# Altium schematic sheet 5_AnalogSense.SchDoc
size A4
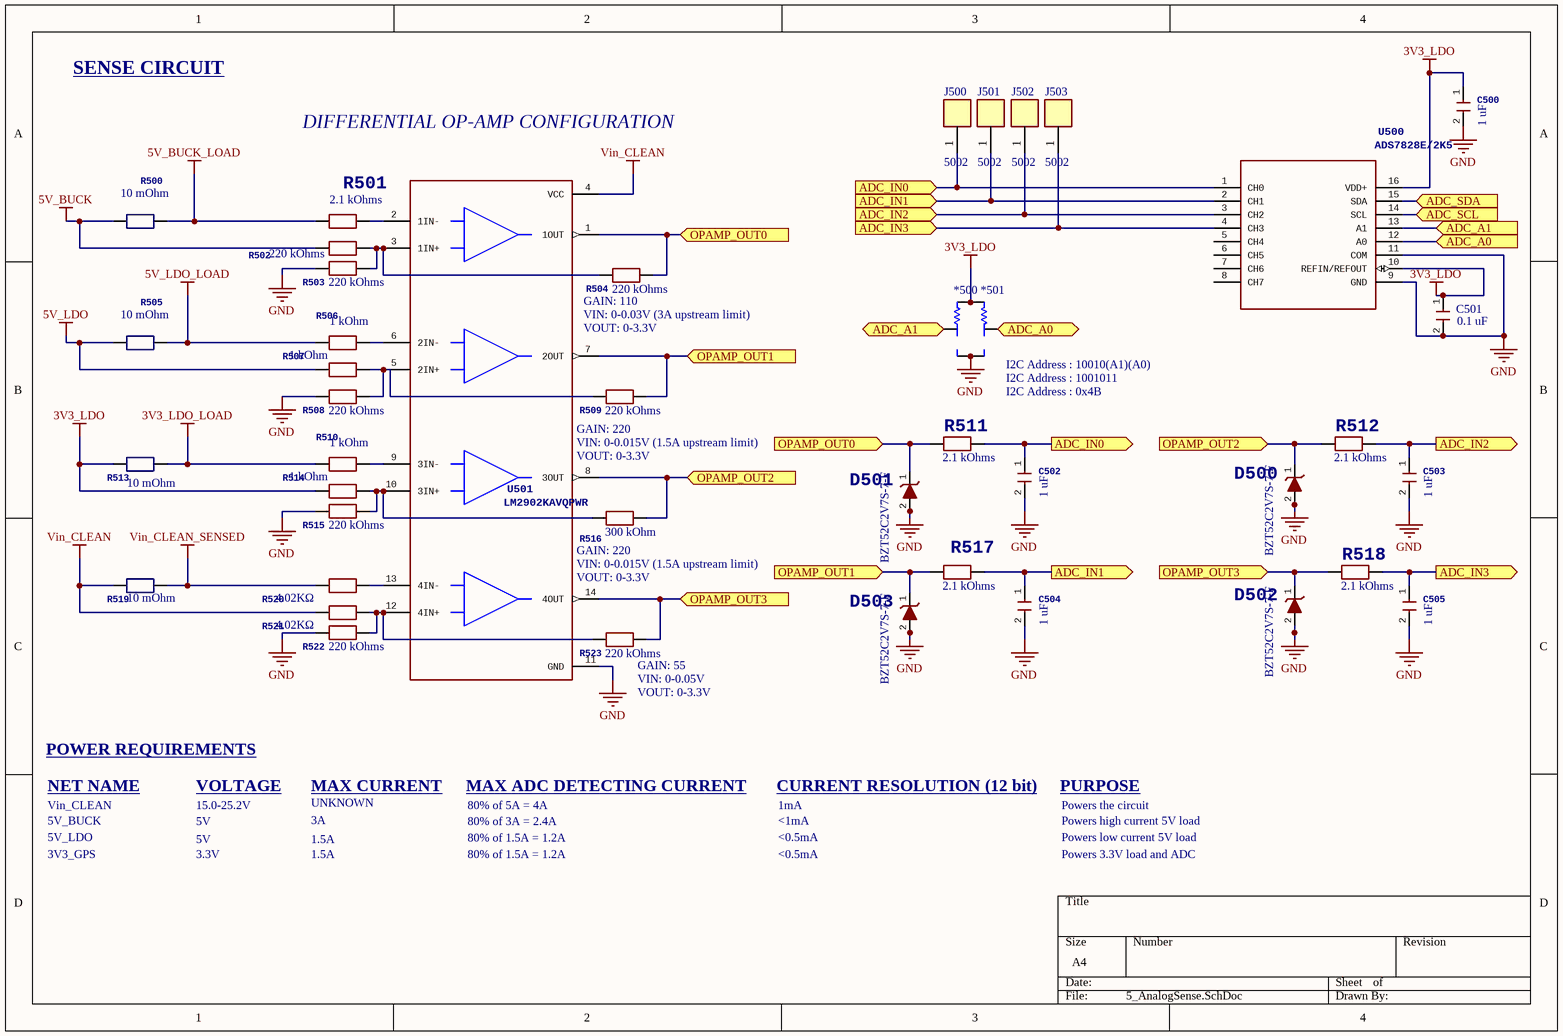
[diagram p0: 5_AnalogSense.SchDoc]

## Parts
*500  3-pin selection 0603  [3-PIN SELECTION CIRCUIT]  (value not drawn)
*501  3-pin selection 0603  [3-PIN SELECTION CIRCUIT]  (value not drawn)
C500  value 1 uF  [CAP_0603]  (hidden comment: GRT188R61H105KE13D)
C501  value 0.1 uF  [CAP_0603]  (hidden comment: CL10B104KB8NNNC)
C502  value 1 uF  [CAP_0603]  (hidden comment: GRT188R61H105KE13D)
C503  value 1 uF  [CAP_0603]  (hidden comment: GRT188R61H105KE13D)
C504  value 1 uF  [CAP_0603]  (hidden comment: GRT188R61H105KE13D)
C505  value 1 uF  [CAP_0603]  (hidden comment: GRT188R61H105KE13D)
D500  BZT52C2V7S-7-F  [DIODE_DO-214AC]
D501  BZT52C2V7S-7-F  [DIODE_DO-214AC]
D502  BZT52C2V7S-7-F  [DIODE_DO-214AC]
D503  BZT52C2V7S-7-F  [DIODE_DO-214AC]
J500  5002  [KEYSTONE_5002]
J501  5002  [KEYSTONE_5002]
J502  5002  [KEYSTONE_5002]
J503  5002  [KEYSTONE_5002]
R500  value 10 mOhm  [RES_0805]  (hidden comment: ERJ6CWFR010V)
R501  value 2.1 kOhms  [RES_0603]  (hidden comment: ERJ-3EKF2101V)
R502  value 220 kOhms  [RES_0603]  (hidden comment: ERJ3EKF2203V)
R503  value 220 kOhms  [RES_0603]  (hidden comment: ERJ3EKF2203V)
R504  value 220 kOhms  [RES_0603]  (hidden comment: ERJ3EKF2203V)
R505  value 10 mOhm  [RES_0805]  (hidden comment: ERJ6CWFR010V)
R506  value 1 kOhm  [RES_0603]  (hidden comment: ERJ3GEYJ102V)
R507  value 1 kOhm  [RES_0603]  (hidden comment: ERJ3GEYJ102V)
R508  value 220 kOhms  [RES_0603]  (hidden comment: ERJ3EKF2203V)
R509  value 220 kOhms  [RES_0603]  (hidden comment: ERJ3EKF2203V)
R510  value 1 kOhm  [RES_0603]  (hidden comment: ERJ3GEYJ102V)
R511  value 2.1 kOhms  [RES_0603]  (hidden comment: ERJ-3EKF2101V)
R512  value 2.1 kOhms  [RES_0603]  (hidden comment: ERJ-3EKF2101V)
R513  value 10 mOhm  [RES_0805]  (hidden comment: ERJ6CWFR010V)
R514  value 1 kOhm  [RES_0603]  (hidden comment: ERJ3GEYJ102V)
R515  value 220 kOhms  [RES_0603]  (hidden comment: ERJ3EKF2203V)
R516  value 300 kOhm  [RES_0603]  (hidden comment: ERJ3GEYJ304V)
R517  value 2.1 kOhms  [RES_0603]  (hidden comment: ERJ-3EKF2101V)
R518  value 2.1 kOhms  [RES_0603]  (hidden comment: ERJ-3EKF2101V)
R519  value 10 mOhm  [RES_0805]  (hidden comment: ERJ6CWFR010V)
R520  value 4.02KΩ  [RES_0603]  (hidden comment: ERA3AEB4021V)
R521  value 4.02KΩ  [RES_0603]  (hidden comment: ERA3AEB4021V)
R522  value 220 kOhms  [RES_0603]  (hidden comment: ERJ3EKF2203V)
R523  value 220 kOhms  [RES_0603]  (hidden comment: ERJ3EKF2203V)
U500  ADS7828E/2K5  [ADC-TSSOP-16]
U501  LM2902KAVQPWR  [OPAMP_TSSOP-14]

## Ports
ADC_A0 (in), ADC_A1 (in), ADC_IN0 (in), ADC_IN0 (out), ADC_IN1 (in), ADC_IN1 (out), ADC_IN2 (in), ADC_IN2 (out), ADC_IN3 (in), ADC_IN3 (out), ADC_SCL (in), ADC_SDA (in), OPAMP_OUT0 (in), OPAMP_OUT1 (in), OPAMP_OUT2 (in), OPAMP_OUT3 (in)

## Nets
3V3_LDO: *500.3 *501.3 C500.1 C501.1 R513.1 R514.1 U500.10(REFIN/REFOUT) U500.16(VDD+)
3V3_LDO_LOAD: R510.1 R513.2
5V_BUCK: R500.1 R502.1
5V_BUCK_LOAD: R500.2 R501.1
5V_LDO: R505.1 R507.1
5V_LDO_LOAD: R505.2 R506.1
GND: *500.1 *501.1 C500.2 C501.2 C502.2 C503.2 C504.2 C505.2 D500.2 D501.2 D502.2 D503.2 R503.1 R508.1 R515.1 R522.1 U500.9(GND) U500.11(COM) U501.11(GND)
Vin_CLEAN: R519.1 R521.1 U501.4(VCC)
Vin_CLEAN_SENSED: R519.2 R520.1
ADC_A0: *501.2 U500.12(A0) ; port ADC_A0
ADC_A1: *500.2 U500.13(A1) ; port ADC_A1
ADC_IN0: C502.1 J500.1 R511.2 U500.1(CH0) ; port ADC_IN0
ADC_IN1: C504.1 J501.1 R517.2 U500.2(CH1) ; port ADC_IN1
ADC_IN2: C503.1 J502.1 R512.2 U500.3(CH2) ; port ADC_IN2
ADC_IN3: C505.1 J503.1 R518.2 U500.4(CH3) ; port ADC_IN3
ADC_SCL: U500.14(SCL) ; port ADC_SCL
ADC_SDA: U500.15(SDA) ; port ADC_SDA
OPAMP_OUT0: D501.1 R504.2 R511.1 U501.1(1OUT) ; port OPAMP_OUT0
OPAMP_OUT1: D503.1 R509.2 R517.1 U501.7(2OUT) ; port OPAMP_OUT1
OPAMP_OUT2: D500.1 R512.1 R516.2 U501.8(3OUT) ; port OPAMP_OUT2
OPAMP_OUT3: D502.1 R518.1 R523.2 U501.14(4OUT) ; port OPAMP_OUT3
NetR501_2: R501.2 U501.2(1IN-)
NetR502_2: R502.2 R503.2 R504.1 U501.3(1IN+)
NetR506_2: R506.2 U501.6(2IN-)
NetR507_2: R507.2 R508.2 R509.1 U501.5(2IN+)
NetR510_2: R510.2 U501.9(3IN-)
NetR514_2: R514.2 R515.2 R516.1 U501.10(3IN+)
NetR520_2: R520.2 U501.13(4IN-)
NetR521_2: R521.2 R522.2 R523.1 U501.12(4IN+)

Not connected (* = marked no-connect by the designer): U500 5(CH4) 6(CH5) 7(CH6) 8(CH7)

## Notes on the sheet
- SENSE CIRCUIT
- DIFFERENTIAL OP-AMP CONFIGURATION
- GAIN: 110
- (near U501) VIN: 0-0.03V (3A upstream limit)
- (near U501) VOUT: 0-3.3V
- (near *501) I2C Address : 10010(A1)(A0)
- (near *501) I2C Address : 1001011
- (near U501) GAIN: 220
- (near U501) VIN: 0-0.015V (1.5A upstream limit)
- I2C Address : 0x4B
- (near R523) GAIN: 55
- (near R523) VIN: 0-0.05V
- VOUT: 0-3.3V
- POWER REQUIREMENTS
- NET NAME
- Vin_CLEAN
- 5V_BUCK
- 5V_LDO
- VOLTAGE
- 15.0-25.2V
- 5V
- MAX CURRENT
- UNKNOWN
- 3A
- 1.5A
- MAX ADC DETECTING CURRENT
- 80% of 5A = 4A
- 80% of 3A = 2.4A
- 80% of 1.5A = 1.2A
- CURRENT RESOLUTION (12 bit)
- 1mA
- <1mA
- <0.5mA
- PURPOSE
- Powers the circuit
- Powers high current 5V load
- Powers low current 5V load
- 3V3_GPS
- 3.3V
- Powers 3.3V load and ADC

## Library data of the parts
C500 C502-C505 = GRT188R61H105KE13D: Cap Ceramic 1uF 50V 0603; Manufacturer: Murata Electronics; PartNumber: GCM188R71C105KA64; Link: https://www.digikey.ca/en/products/detail/murata-electronics/GRT188R61H105KE13D/5416752?s=N4IgTCBcDaIOICUAqBGAHGhA2FAJFADAKwDSAoigMwAiIAugL5A; Package: 0603; SupplierPartNumber: 490-12330-2-ND; SuppliersPartNumber: C126631
C501 = CL10B104KB8NNNC: Cap Ceramic 0.1uF 50V 0603; Manufacturer_Name: Samsung; Link: https://www.digikey.ca/en/products/detail/samsung-electro-mechanics/CL10B104KB8NNNC/3886658?s=N4IgTCBcDaIMIBkCMAGAQqgLAaTQDgDki4QBdAXyA; Package: 0603; PartNumber: CL10B104KB8NNNC; SupplierPartNumber: 1276-1000-2-ND; SuppliersPartNumber: C1591
D500-D503 = BZT52C2V7S-7-F: Diode Zener 2V7; Manufacturer: Diodes Inc; Value: TVS 2V7; Link: https://www.digikey.ca/en/products/detail/diodes-incorporated/BZT52C2V7S-7-F/739746; Package: SOD-323; PartNumber: BZT52C2V7S-7-F; SupplierPartNumber: BZT52C2V7S-FDITR-ND; SuppliersPartNumber: C260926
J500-J503 = 5002: Test Point Ring Keystone; Manufacturer: Keystone Electronics; Value: Test Point Keystone Electronics; Package: *; PartNumber: 5002; SupplierNumber: 36-5002-ND; SuppliersPartNumber: C238123; Link: https://www.digikey.ca/en/products/detail/keystone-electronics/5002/255328
R500 R505 R513 R519 = ERJ6CWFR010V: Res 10mOhm 1/2W Sense Resistor 0805; Link: https://www.digikey.ca/en/products/detail/panasonic-electronic-components/ERJ-6CWFR010V/6004279?s=N4IgTCBcDaIKICUBSA2AwgdQGIIAwEZcA1EAXQF8g; Package: 0805; PartNumber: ERJ6CWFR010V; SupplierPartNumber: P19196CT-ND; SuppliersPartNumber: C236283
R501 = ERJ-3EKF2101VRC0603N_PAN-M: Res 2.1KOhms 1/10W 0603; Link: https://www.digikey.ca/en/products/detail/panasonic-electronic-components/ERJ-3EKF2101V/196185; Package: 0603; PartNumber: ERJ-3EKF2101V; SupplierNumber: P2.10KHDKR-ND; SuppliersPartNumber: C403065
R502-R504 R508 R509 R515 R522 R523 = ERJ3EKF2203V: Res 220kOhms 1/10W 0603; Link: https://www.digikey.ca/en/products/detail/panasonic-electronic-components/ERJ-3EKF2203V/1746338?s=N4IgTCBcDaIKICUBSBmOBpAYmMAGFAaiALoC%2BQA; Package: 0603; PartNumber: ERJ3EKF2203V; SupplierPartNumber: P220KHTR-ND; SuppliersPartNumber: C403074
R506 R507 R510 R514 = ERJ3GEYJ102V: Res 1kOhm 1/10W 0603; Manufacturer_Name: Panasonic; SymbolName_1: ERJ3GEYJ102V; Link: https://www.digikey.ca/en/products/detail/panasonic-electronic-components/ERJ-3GEYJ102V/68472?s=N4IgTCBcDaIKICUBSBmA4nAmkgjABjADUQBdAXyA; Package: 0603; PartNumber: ERJ3GEYJ102V; SupplierPartNumber: P1.0KGCT-ND; SuppliersPartNumber: C180848
R511 R512 R517 R518 = ERJ-3EKF2101V: Res 2.1KOhms 1/10W 0603; Link: https://www.digikey.ca/en/products/detail/panasonic-electronic-components/ERJ-3EKF2101V/196185; Package: 0603; PartNumber: ERJ-3EKF2101V; SupplierNumber: P2.10KHDKR-ND; SuppliersPartNumber: C403065
R516 = ERJ3GEYJ304V: Res 300kOhm 1/10W 0603; Manufacturer_Name: Panasonic; Link: https://www.digikey.ca/en/products/detail/panasonic-electronic-components/ERJ-3GEYJ304V/135883; Package: 0603; SupplierPartNumber: P300KGTR-ND; SuppliersPartNumber: C403476; PartNumber: ERJ3GEYJ304V
R520 R521 = ERA3AEB4021V: Res 4.02KOhm 1/10W 0603; Manufacturer_Name: Panasonic; PartNumber: ERJ3GEYJ200V; Link: https://www.digikey.ca/en/products/detail/panasonic-electronic-components/ERA-3AEB4021V/2026802?s=N4IgTCBcDaIKICUCCBmJcBCAWADGAjAGogC6AvkA; Package: 0603; SupplierPartNumber: P4.02KDBTR-ND; SuppliersPartNumber: C491130
U500 = ADS7828E/2K5: ADC 12bit 8Ch; Manufacturer: Texas Instruments; PartNumber: ADS7828E/2K5; SupplierNumber: 2156-ADS7828E/2K5-ND; Value: *; Link: https://www.digikey.ca/en/products/detail/texas-instruments/ADS7828E-2K5/1689481; Package: TSSOP-16
U501 = LM2902KAVQPWR: OpAmps 4Channel; Manufacturer: Texas Instruments; Link: https://www.digikey.ca/en/products/detail/texas-instruments/LM2902KAVQPWR/857694; PartNumber: LM2902KAVQPWR; SupplierNumber: 296-28750-2-ND; SuppliersPartNumber: C496124; Package: TSSOP-14; Value: *